# Altium schematic sheet 0114_AUDIO - LOAD SWITC.SchDoc
size 848 x 558 mm
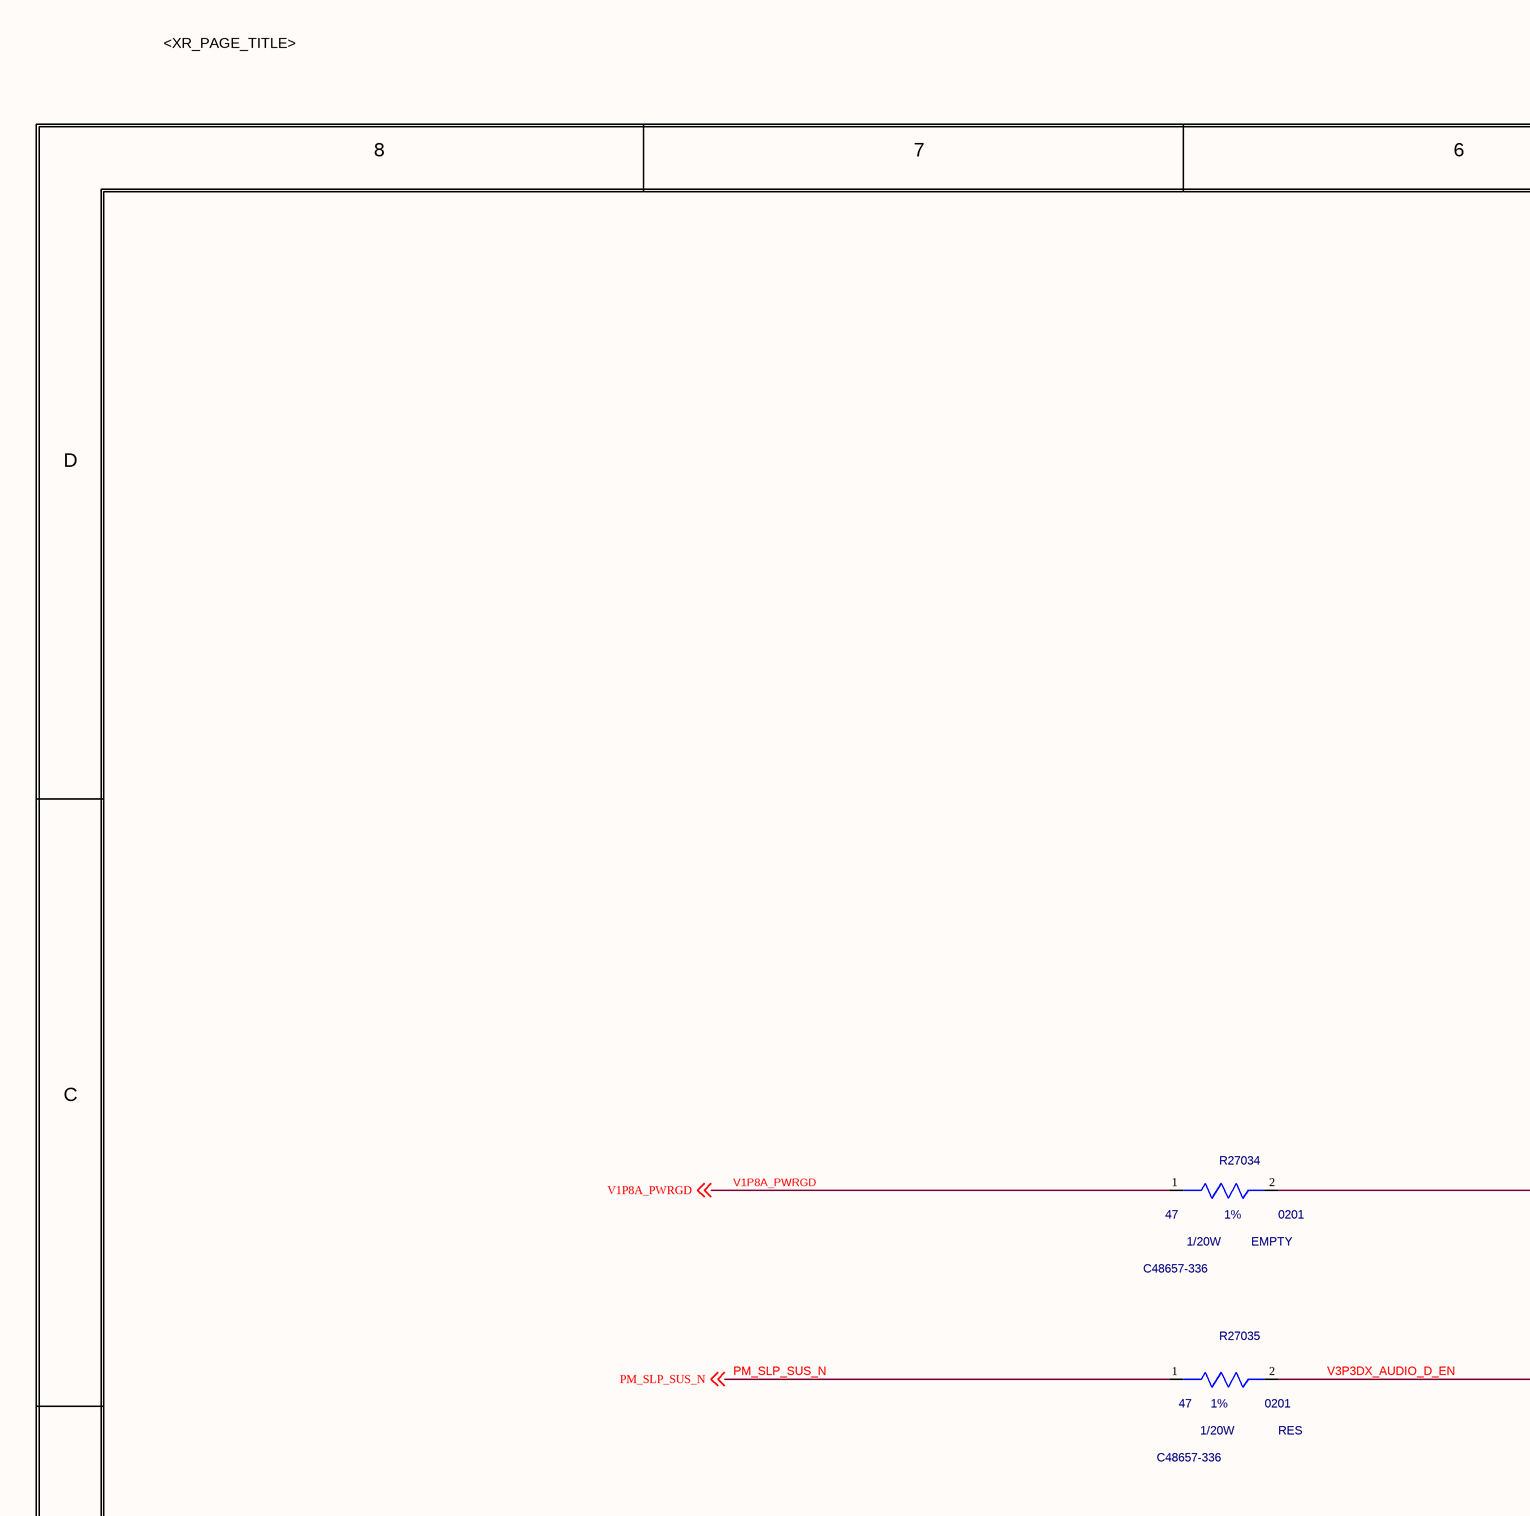
[diagram p0: 0114_AUDIO - LOAD SWITC.SchDoc, top left]
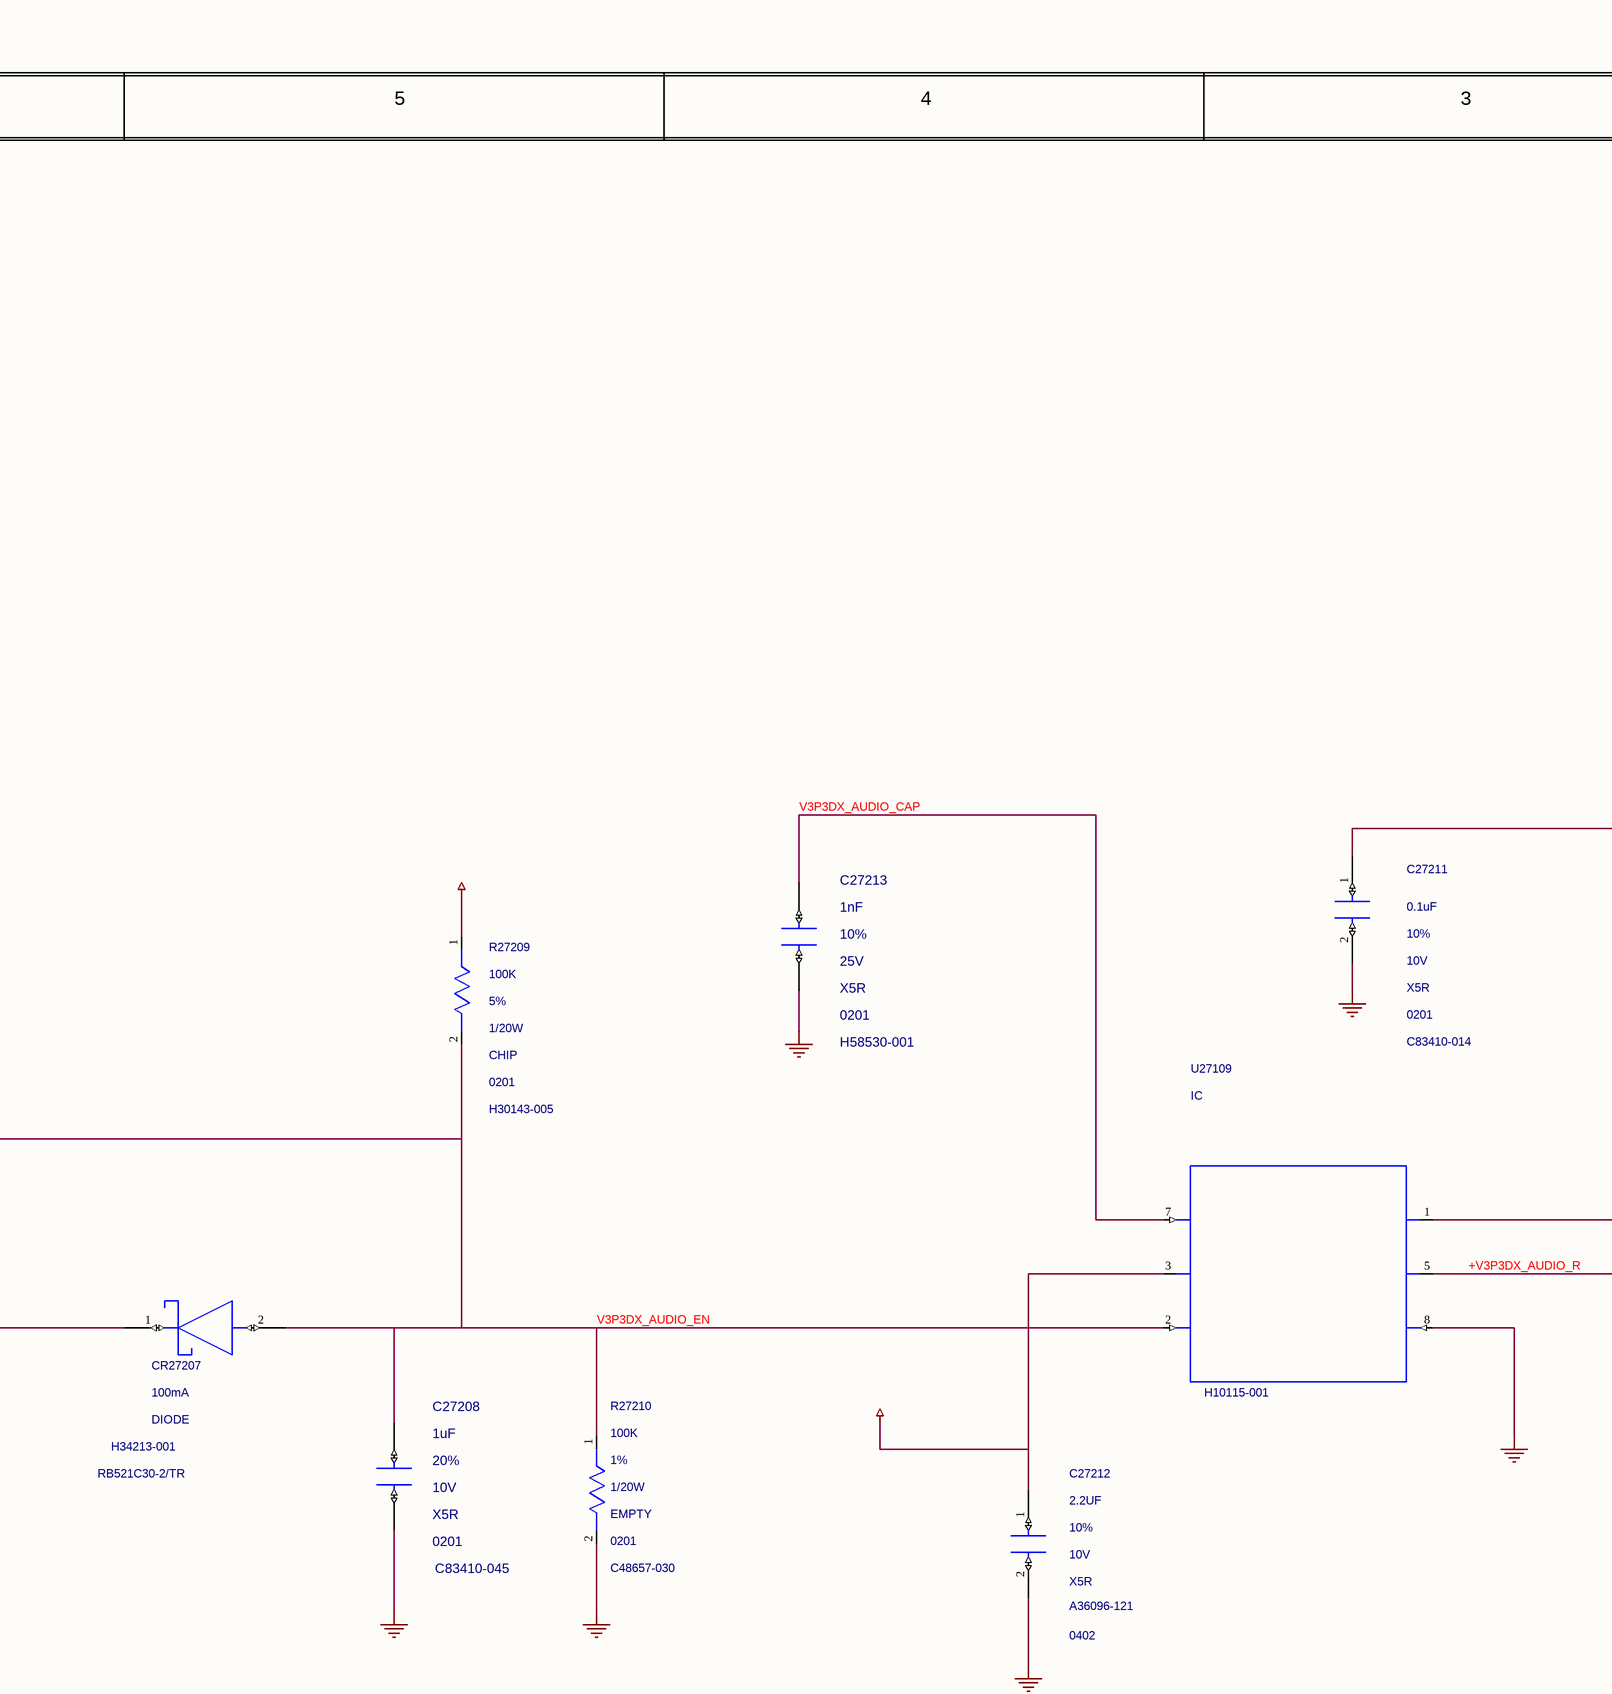
[diagram p1: 0114_AUDIO - LOAD SWITC.SchDoc, top middle]
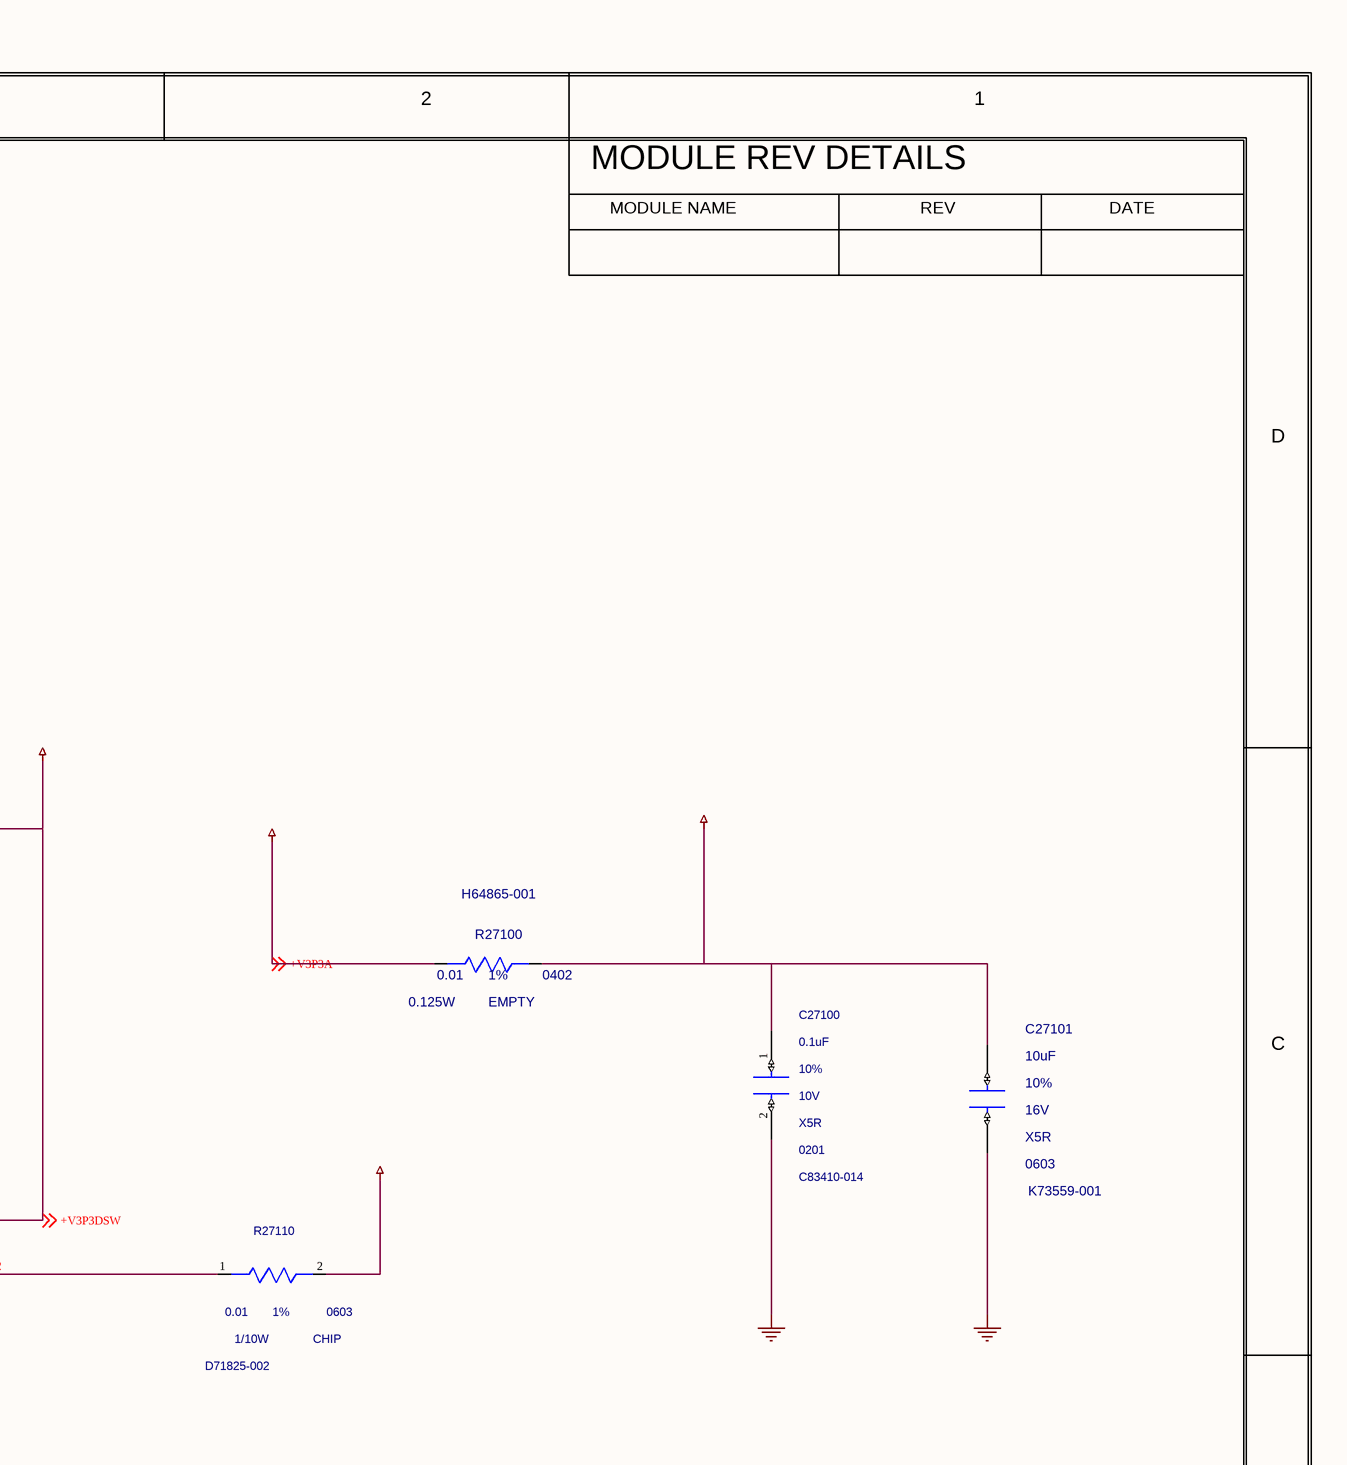
[diagram p2: 0114_AUDIO - LOAD SWITC.SchDoc, top right]
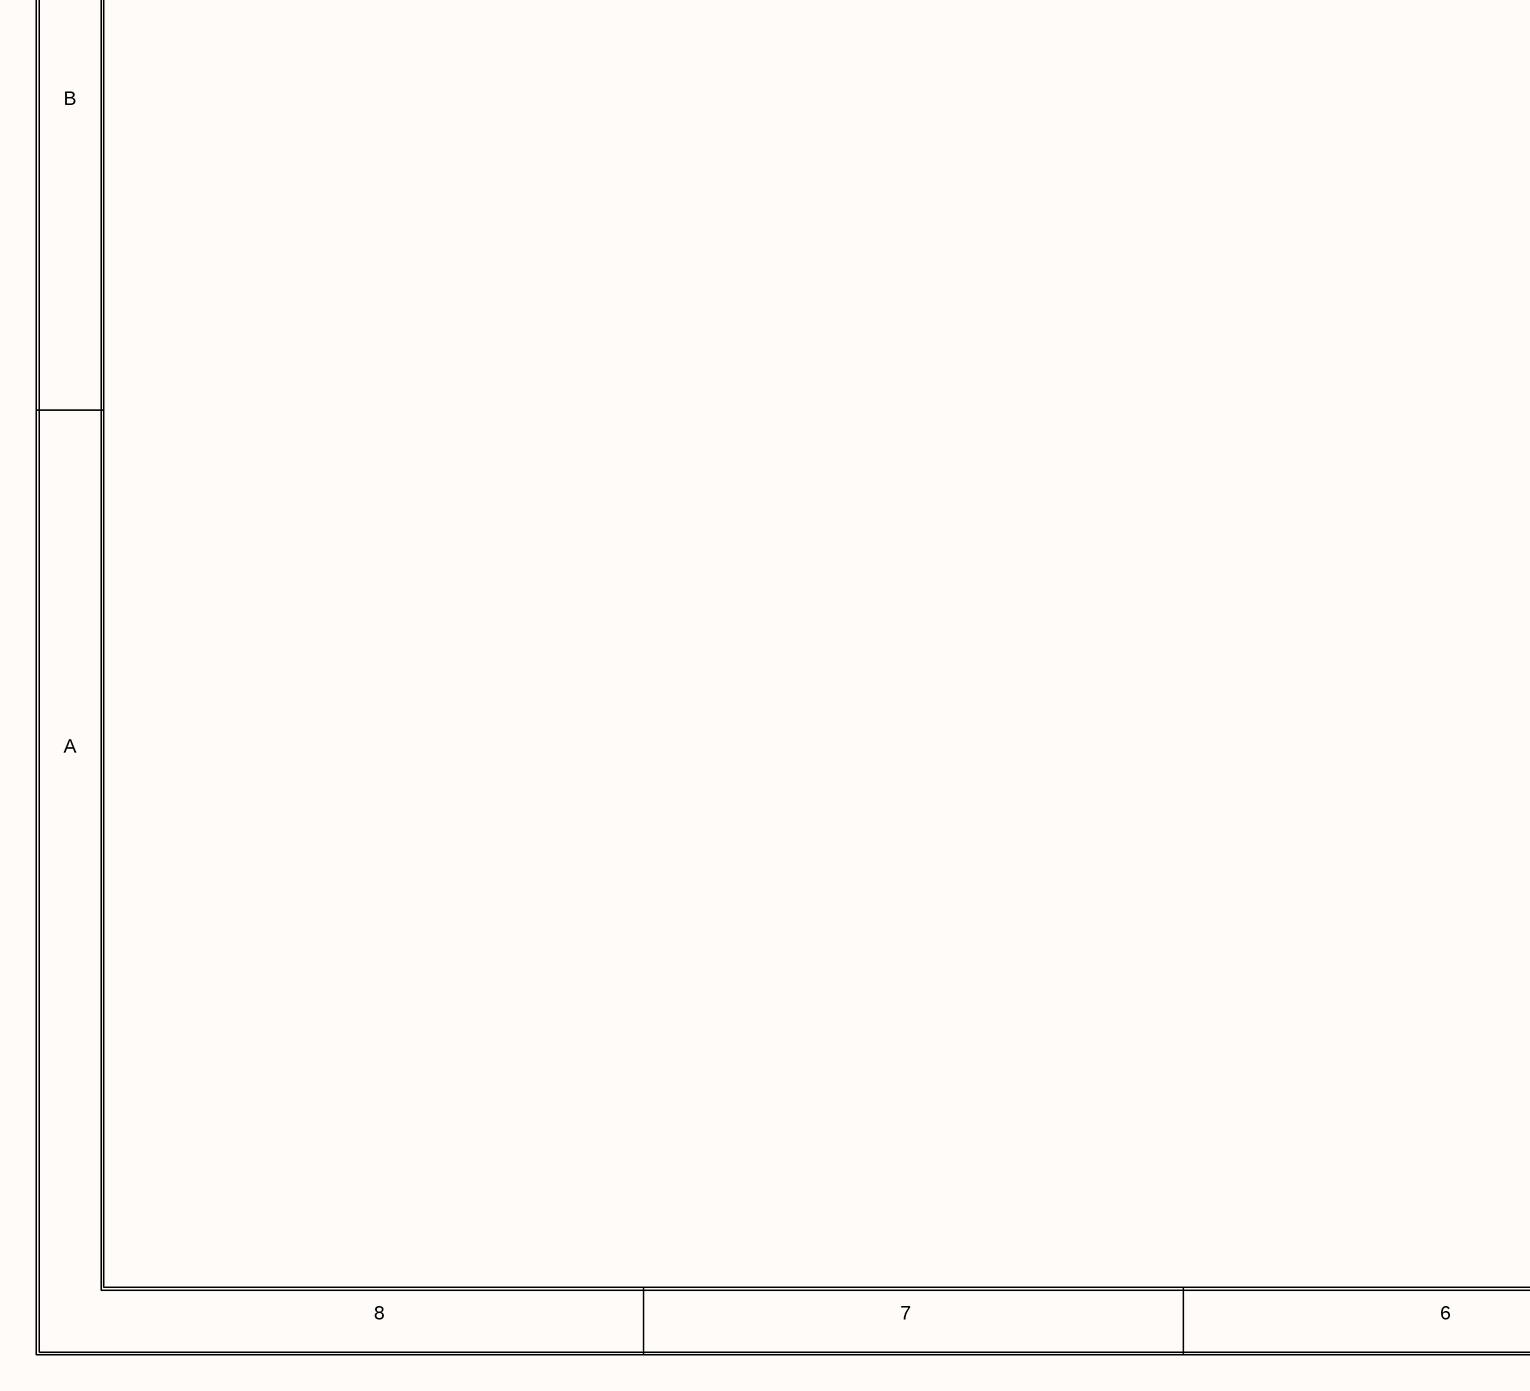
[diagram p3: 0114_AUDIO - LOAD SWITC.SchDoc, bottom left]
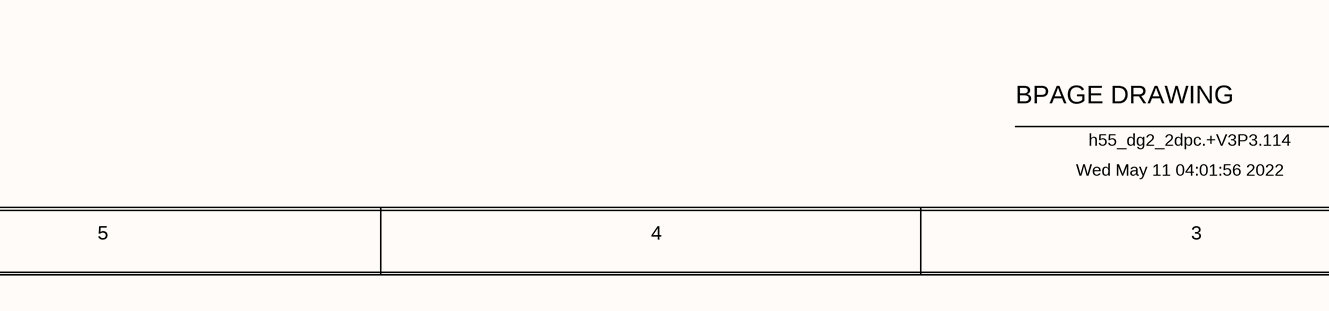
[diagram p4: 0114_AUDIO - LOAD SWITC.SchDoc, bottom middle]
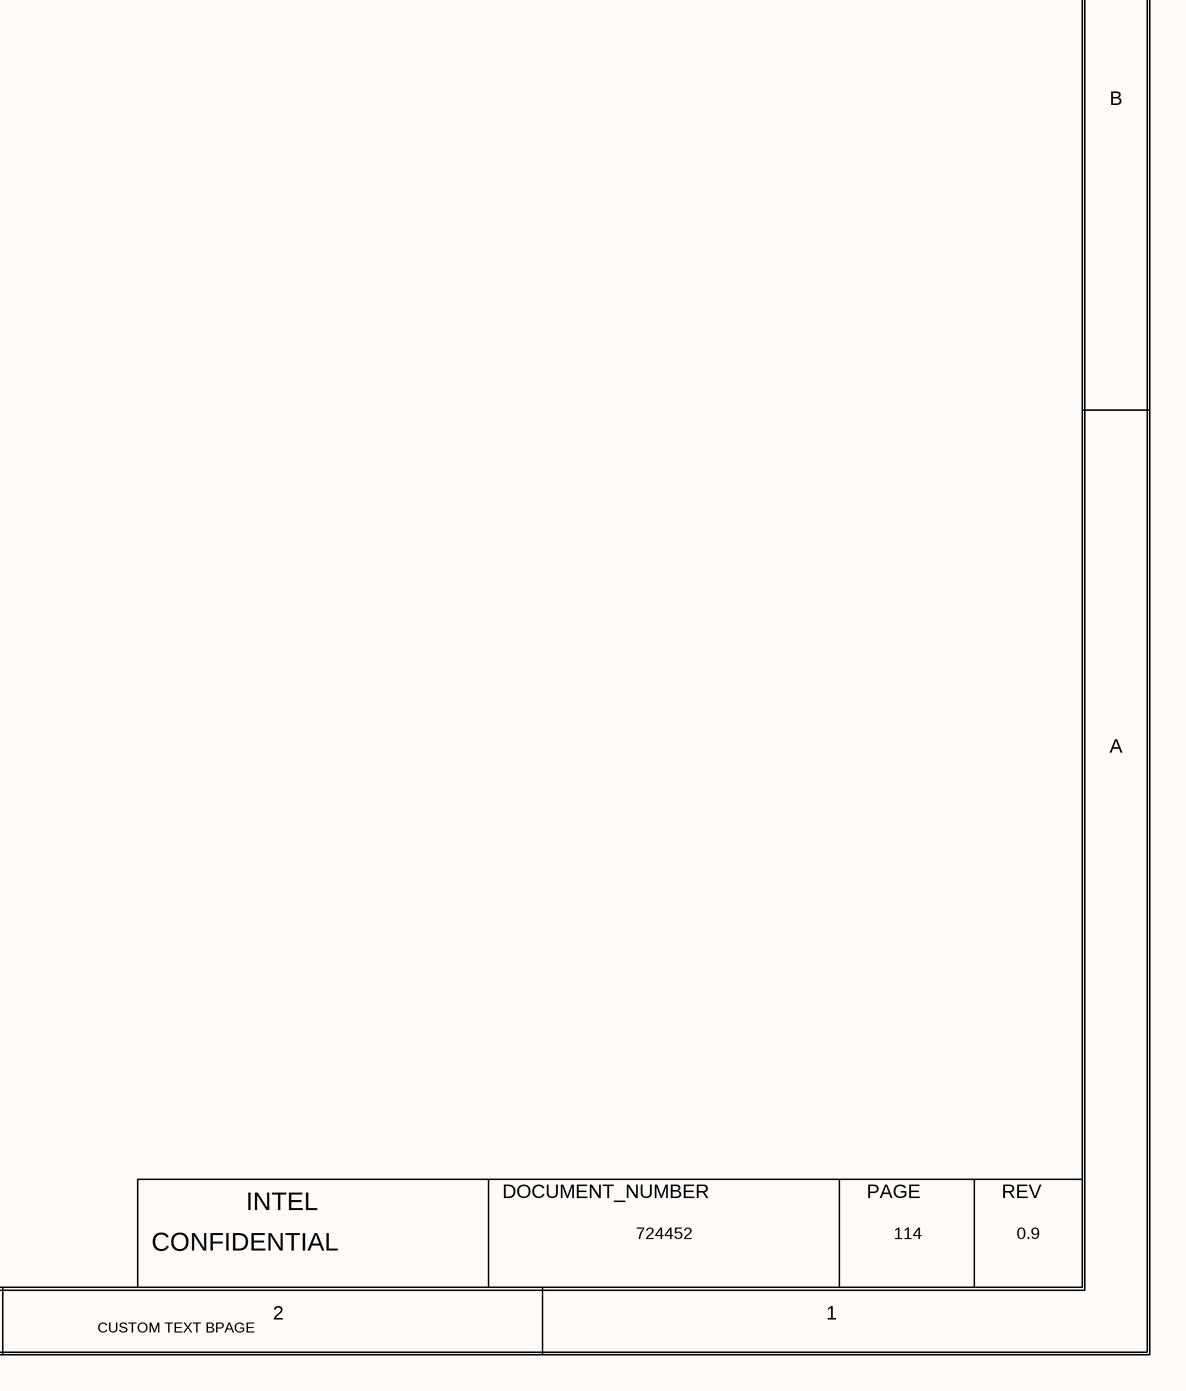
[diagram p5: 0114_AUDIO - LOAD SWITC.SchDoc, bottom right]

## Parts
C27100  0.1uF  MATERIAL: X5R  PACK_TYPE: 0201  PART_NUMBER: C83410-014  TOLERANCE: 10%  VOLTAGE: 10V  [SMC0201IA]
C27101  10uF  MATERIAL: X5R  PACK_TYPE: 0603  PART_NUMBER: K73559-001  TOLERANCE: 10%  VOLTAGE: 16V  [TK0_SM0603_1800X1000_ML]
C27208  1uF  MATERIAL: X5R  PACK_TYPE: 0201  PART_NUMBER: C83410-045  TOLERANCE: 20%  VOLTAGE: 10V  [TK0_SM0201_690X390_MA]
C27211  0.1uF  MATERIAL: X5R  PACK_TYPE: 0201  PART_NUMBER: C83410-014  TOLERANCE: 10%  VOLTAGE: 10V  [SMC0201IA]
C27212  2.2UF  MATERIAL: X5R  PACK_TYPE: 0402  PART_NUMBER: A36096-121  TOLERANCE: 10%  VOLTAGE: 10V  [SMC0402IA]
C27213  1nF  MATERIAL: X5R  PACK_TYPE: 0201  PART_NUMBER: H58530-001  TOLERANCE: 10%  VOLTAGE: 25V  [CTK0_SM0201_630X330_MA]
CR27207  RB521C30-2/TR  CURRENT: 100mA  MATERIAL: DIODE  PART_NUMBER: H34213-001  [SOD923MA]
R27034  47  MATERIAL: EMPTY  PACK_TYPE: 0201  PART_NUMBER: C48657-336  TOLERANCE: 1%  WATTAGE: 1/20W  [SMR0201MB]
R27035  47  MATERIAL: RES  PACK_TYPE: 0201  PART_NUMBER: C48657-336  TOLERANCE: 1%  WATTAGE: 1/20W  [SMR0201MB]
R27100  0.01  MATERIAL: EMPTY  PACK_TYPE: 0402  PART_NUMBER: H64865-001  TOLERANCE: 1%  WATTAGE: 0.125W  [TK0_SM0402_1100X650_MA]
R27110  0.01  MATERIAL: CHIP  PACK_TYPE: 0603  PART_NUMBER: D71825-002  TOLERANCE: 1%  WATTAGE: 1/10W  [SMR0603IB]
R27209  100K  MATERIAL: CHIP  PACK_TYPE: 0201  PART_NUMBER: H30143-005  TOLERANCE: 5%  WATTAGE: 1/20W  [SMR0201IA]
R27210  100K  MATERIAL: EMPTY  PACK_TYPE: 0201  PART_NUMBER: C48657-030  TOLERANCE: 1%  WATTAGE: 1/20W  [SMR0201MC]
U27109  MATERIAL: IC  PART_NUMBER: H10115-001  [CTK1_LCC8_1050X1650_400_MA]  (hidden comment: C_SLG5NT1458V)

## Nets
+V3P3A: R27100.1(A) R27209.1(A) ; off-sheet +V3P3A
+V3P3DSW: C27211.1(A) C27212.1(A) U27109.1(VDD) U27109.3(D) ; off-sheet +V3P3DSW
+V3P3DX_AUDIO: C27100.1(A) C27101.1(A) R27100.2(B) R27110.2(B)
GND: C27100.2(B) C27101.2(B) C27208.2(B) C27211.2(B) C27212.2(B) C27213.2(B) R27210.2(B) U27109.8(GND)
+V3P3DX_AUDIO_R: R27110.1(A) U27109.5(S)
PM_SLP_SUS_N: R27035.1(A) ; off-sheet PM_SLP_SUS_N
V1P8A_PWRGD: R27034.1(A) ; off-sheet V1P8A_PWRGD
V3P3DX_AUDIO_CAP: C27213.1(A) U27109.7(CAP)
V3P3DX_AUDIO_D_EN: CR27207.1(CATHODE) R27035.2(B)
V3P3DX_AUDIO_EN: C27208.1(A) CR27207.2(ANODE) R27034.2(B) R27209.2(B) R27210.1(A) U27109.2(ON)

## Notes on the sheet
- <XR_PAGE_TITLE>
- 8
- 7
- 6
- 5
- 4
- 3
- 2
- 1
- MODULE REV DETAILS
- MODULE NAME
- REV
- DATE
- D
- C
- B
- A
- BPAGE DRAWING
- INTEL
- DOCUMENT_NUMBER
- PAGE
- Wed May 11 04:01:56 2022
- h55_dg2_2dpc.+V3P3.114
- CONFIDENTIAL
- 724452
- 114
- 0.9
- CUSTOM TEXT BPAGE

## Library data of the parts
C27100 = CAP: CDS_PHYS_PART_NAME: CAP_0201-C83410-014,X5R,0.1UF,10V,10%,LPDB,GENERIC; OriginalSymbolOrigin: (-50,25); XY: (-1075,3350); VER: 1; ROT: 0; PHYS_PAGE: 114; LOCATION: C27100; DRAWING: @RVP1_ADL_SB_ADP_S_DDR5_SODIMM_2DPC_LIB.H55_DG2_2DPC(SCH_1):PAGE485; CDS_LIB: discrete; PCB Footprint: SMC0201IA; CHIPS_PART_NAME: CAP; CDS_PART_NAME: CAP_0201-C83410-014,X5R,0.1UF,10V,10%,LPDB,GENERIC; CDS_LOCATION: C27100
C27101 = CAP_2: CDS_PHYS_PART_NAME: CAP_2_0603-K73559-001,X5R,10UF,16V,10%,TK0,GENERIC; BOM_USE: STUFF; CDS_LMAN_SYM_OUTLINE: -50,50,50,-50; FP_TECH: TK0; IP: GENERIC; ROOM: NONE; OriginalSymbolOrigin: (-50,25); XY: (-675,3325); VER: 1; ROT: 0; PHYS_PAGE: 114; LOCATION: C27101; DRAWING: @RVP1_ADL_SB_ADP_S_DDR5_SODIMM_2DPC_LIB.H55_DG2_2DPC(SCH_1):PAGE485; CDS_LIB: discrete_2; VARIANT: ?; PCB Footprint: TK0_SM0603_1800X1000_ML; CHIPS_PART_NAME: CAP_2; CDS_PART_NAME: CAP_2_0603-K73559-001,X5R,10UF,16V,10%,TK0,GENERIC; CDS_LOCATION: C27101
C27208 = CAP_2: CDS_PHYS_PART_NAME: CAP_2_0201-C83410-045,X5R,1UF,10V,20%,TK0,GENERIC; BOM_USE: STUFF; CDS_LMAN_SYM_OUTLINE: -50,50,50,-50; FP_TECH: TK0; IP: GENERIC; ROOM: NONE; OriginalSymbolOrigin: (-50,25); XY: (-4700,2625); VER: 1; ROT: 0; PHYS_PAGE: 114; LOCATION: C27208; DRAWING: @RVP1_ADL_SB_ADP_S_DDR5_SODIMM_2DPC_LIB.H55_DG2_2DPC(SCH_1):PAGE485; CDS_LIB: discrete_2; VARIANT: ?; PCB Footprint: TK0_SM0201_690X390_MA; CHIPS_PART_NAME: CAP_2; CDS_PART_NAME: CAP_2_0201-C83410-045,X5R,1UF,10V,20%,TK0,GENERIC; CDS_LOCATION: C27208
C27211 = CAP: CDS_PHYS_PART_NAME: CAP_0201-C83410-014,X5R,0.1UF,10V,10%,LPDB,GENERIC; OriginalSymbolOrigin: (-50,25); XY: (-2925,3675); VER: 1; SUB_ROOM_2: DECOUPLING; SUB_ROOM_1: V3P3DX_AUDIO; SUB_ROOM: V3P3A; ROT: 2; PHYS_PAGE: 114; LOCATION: C27211; DRAWING: @RVP1_ADL_SB_ADP_S_DDR5_SODIMM_2DPC_LIB.H55_DG2_2DPC(SCH_1):PAGE485; CDS_LIB: discrete; PCB Footprint: SMC0201IA; CHIPS_PART_NAME: CAP; CDS_PART_NAME: CAP_0201-C83410-014,X5R,0.1UF,10V,10%,LPDB,GENERIC; CDS_LOCATION: C27211
C27212 = CAP: CDS_PHYS_PART_NAME: CAP_0402-A36096-121,X5R,2.2UF,10V,10%,LPDB,GENERIC; OriginalSymbolOrigin: (-50,25); XY: (-3525,2500); VER: 1; SUB_ROOM_2: DECOUPLING; SUB_ROOM_1: V3P3DX_AUDIO; SUB_ROOM: V3P3A; ROT: 2; PHYS_PAGE: 114; LOCATION: C27212; DRAWING: @RVP1_ADL_SB_ADP_S_DDR5_SODIMM_2DPC_LIB.H55_DG2_2DPC(SCH_1):PAGE485; CDS_LIB: discrete; PCB Footprint: SMC0402IA; CHIPS_PART_NAME: CAP; CDS_PART_NAME: CAP_0402-A36096-121,X5R,2.2UF,10V,10%,LPDB,GENERIC; CDS_LOCATION: C27212
C27213 = C_CAP: CDS_PHYS_PART_NAME: C_CAP_0201-H58530-001,X5R,1NF,25V,10%,TK0,GENERIC; CDS_LMAN_SYM_OUTLINE: -50,50,50,-50; FP_TECH: TK0; IP: GENERIC; ROOM: NONE; OriginalSymbolOrigin: (-50,25); XY: (-3950,3625); VER: 1; ROT: 0; PHYS_PAGE: 114; LOCATION: C27213; DRAWING: @RVP1_ADL_SB_ADP_S_DDR5_SODIMM_2DPC_LIB.H55_DG2_2DPC(SCH_1):PAGE485; CDS_LIB: c_discrete; VARIANT: ?; PCB Footprint: CTK0_SM0201_630X330_MA; SEC_TYPE: 0201; CHIPS_PART_NAME: C_CAP; CDS_PART_NAME: C_CAP_0201-H58530-001,X5R,1NF,25V,10%,TK0,GENERIC; CDS_LOCATION: C27213
CR27207 = DIODE_SCHOTTKY#1: CDS_PHYS_PART_NAME: DIODE_SCHOTTKY_SM-H34213-001,DIODE,RB521C30-2/TR,100MA,LPDB,GENA; CDS_LMAN_SYM_OUTLINE: -50,100,50,-100; PACK_TYPE: SM; OriginalSymbolOrigin: (-75,50); XY: (-5050,2900); VER: 2; SUB_ROOM_2: MISC; SUB_ROOM_1: V3P3DX_AUDIO; SUB_ROOM: V1.8A; ROT: 0; PHYS_PAGE: 114; LOCATION: CR27207; IP: GENERIC; FP_TECH: LPDB; DRAWING: @RVP1_ADL_SB_ADP_S_DDR5_SODIMM_2DPC_LIB.H55_DG2_2DPC(SCH_1):PAGE485; CDS_LIB: discrete; PCB Footprint: SOD923MA; CHIPS_PART_NAME: DIODE_SCHOTTKY; CDS_PART_NAME: DIODE_SCHOTTKY_SM-H34213-001,DIODE,RB521C30-2/TR,100MA,LPDB,GENA; CDS_LOCATION: CR27207
R27034 = RES#1: CHIPS_PART_NAME: RES; CDS_PHYS_PART_NAME: RES_0201-C48657-336,EMPTY,47,1%,1/20W,LPDB,GENERIC; OriginalSymbolOrigin: (-75,25); XY: (-6125,3250); VER: 1; ROT: 0; PHYS_PAGE: 114; LOCATION: R27034; IP: GENERIC; FP_TECH: LPDB; DRAWING: @RVP1_ADL_SB_ADP_S_DDR5_SODIMM_2DPC_LIB.H55_DG2_2DPC(SCH_1):PAGE485; CDS_LIB: discrete; PCB Footprint: SMR0201MB; CDS_PART_NAME: RES_0201-C48657-336,EMPTY,47,1%,1/20W,LPDB,GENERIC; CDS_LOCATION: R27034
R27035 = RES#1: CDS_PHYS_PART_NAME: RES_0201-C48657-336,RES,47,1%,1/20W,LPDB,GENERIC; OriginalSymbolOrigin: (-75,25); XY: (-6125,2900); VER: 1; ROT: 0; PHYS_PAGE: 114; LOCATION: R27035; IP: GENERIC; FP_TECH: LPDB; DRAWING: @RVP1_ADL_SB_ADP_S_DDR5_SODIMM_2DPC_LIB.H55_DG2_2DPC(SCH_1):PAGE485; CDS_LIB: discrete; PCB Footprint: SMR0201MB; CHIPS_PART_NAME: RES; CDS_PART_NAME: RES_0201-C48657-336,RES,47,1%,1/20W,LPDB,GENERIC; CDS_LOCATION: R27035
R27100 = RES_2#1: CHIPS_PART_NAME: RES_2; CDS_PHYS_PART_NAME: RES_2_0402-H64865-001,EMPTY,0.01,1%,0.125W,TK0,GENERIC; BOM_USE: STUFF; CDS_LMAN_SYM_OUTLINE: -50,50,50,-50; FP_TECH: TK0; IP: GENERIC; ROOM: NONE; OriginalSymbolOrigin: (-75,25); XY: (-1600,3575); VER: 1; ROT: 0; PHYS_PAGE: 114; LOCATION: R27100; DRAWING: @RVP1_ADL_SB_ADP_S_DDR5_SODIMM_2DPC_LIB.H55_DG2_2DPC(SCH_1):PAGE485; CDS_LIB: discrete_2; VARIANT: ?; PCB Footprint: TK0_SM0402_1100X650_MA; CDS_PART_NAME: RES_2_0402-H64865-001,EMPTY,0.01,1%,0.125W,TK0,GENERIC; CDS_LOCATION: R27100
R27110 = RES#1: CHIPS_PART_NAME: RES; CDS_PHYS_PART_NAME: RES_0603-D71825-002,CHIP,0.01,1%,1/10W,LPDB,GENERIC; OriginalSymbolOrigin: (-75,25); XY: (-2000,3000); VER: 1; ROT: 0; PHYS_PAGE: 114; LOCATION: R27110; IP: GENERIC; FP_TECH: LPDB; DRAWING: @RVP1_ADL_SB_ADP_S_DDR5_SODIMM_2DPC_LIB.H55_DG2_2DPC(SCH_1):PAGE485; CDS_LIB: discrete; PCB Footprint: SMR0603IB; CDS_PART_NAME: RES_0603-D71825-002,CHIP,0.01,1%,1/10W,LPDB,GENERIC; CDS_LOCATION: R27110
R27209 = RES: CDS_PHYS_PART_NAME: RES_0201-H30143-005,CHIP,100K,5%,1/20W,LPDB,GENERIC; OriginalSymbolOrigin: (-25,75); XY: (-4575,3525); VER: 2; SUB_ROOM_2: PUPD; SUB_ROOM_1: V3P3DX_AUDIO; ROT: 0; PHYS_PAGE: 114; LOCATION: R27209; IP: GENERIC; FP_TECH: LPDB; DRAWING: @RVP1_ADL_SB_ADP_S_DDR5_SODIMM_2DPC_LIB.H55_DG2_2DPC(SCH_1):PAGE485; CDS_LIB: discrete; PCB Footprint: SMR0201IA; CHIPS_PART_NAME: RES; CDS_PART_NAME: RES_0201-H30143-005,CHIP,100K,5%,1/20W,LPDB,GENERIC; CDS_LOCATION: R27209
R27210 = RES: CDS_PHYS_PART_NAME: RES_0201-C48657-030,EMPTY,100K,1%,1/20W,LPDB,GENERIC; OriginalSymbolOrigin: (-25,75); XY: (-4325,2600); VER: 2; SUB_ROOM_2: PLACEHOLDER; SUB_ROOM_1: V3P3DX_AUDIO; ROT: 0; PHYS_PAGE: 114; LOCATION: R27210; IP: GENERIC; FP_TECH: LPDB; DRAWING: @RVP1_ADL_SB_ADP_S_DDR5_SODIMM_2DPC_LIB.H55_DG2_2DPC(SCH_1):PAGE485; CDS_LIB: discrete; PCB Footprint: SMR0201MC; CHIPS_PART_NAME: RES; CDS_PART_NAME: RES_0201-C48657-030,EMPTY,100K,1%,1/20W,LPDB,GENERIC; CDS_LOCATION: R27210
U27109 = C_SLG5NT1458V: CDS_PHYS_PART_NAME: C_SLG5NT1458V_LCC-H10115-001,IC,SLG5NT1458V,TK1,GENERIC; CDS_LMAN_SYM_OUTLINE: -200,200,200,-200; FP_TECH: TK1; IP: GENERIC; PACK_TYPE: LCC; ROOM: NONE; OriginalSymbolOrigin: (-225,200); XY: (-3025,3000); VER: 1; ROT: 0; PHYS_PAGE: 114; LOCATION: U27109; DRAWING: @RVP1_ADL_SB_ADP_S_DDR5_SODIMM_2DPC_LIB.H55_DG2_2DPC(SCH_1):PAGE485; CDS_LIB: local; VARIANT: ?; PCB Footprint: CTK1_LCC8_1050X1650_400_MA; CHIPS_PART_NAME: C_SLG5NT1458V; CDS_PART_NAME: C_SLG5NT1458V_LCC-H10115-001,IC,SLG5NT1458V,TK1,GENERIC; CDS_LOCATION: U27109